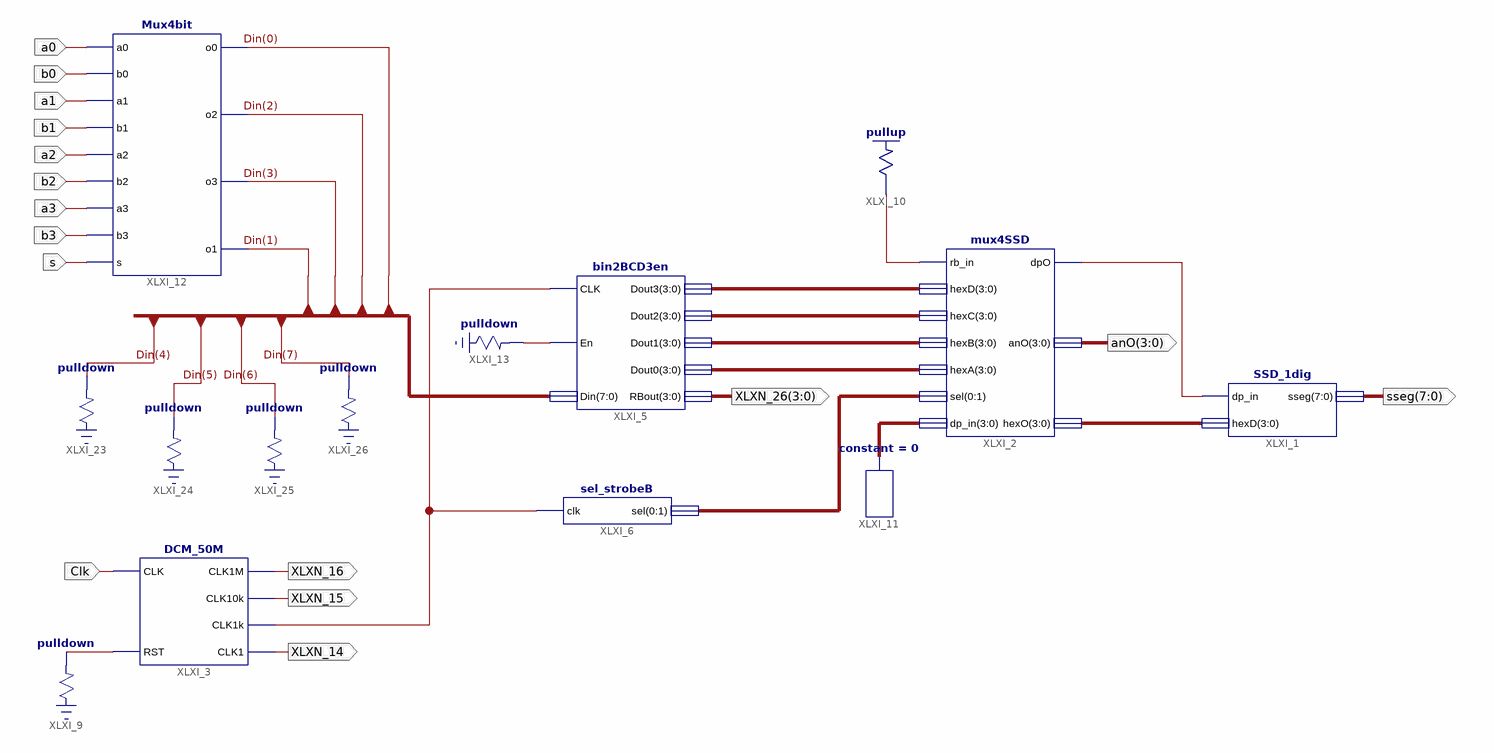
[diagram p0: schematic sheet 1]
// Xilinx ISE schematic Lab6Exp5.sch (spartan3e) as structural Verilog: 14 symbols, 16 ports
module Lab6Exp5 (
  input  a0,
  input  b2,
  input  a2,
  input  b1,
  input  a1,
  input  b0,
  input  a3,
  input  b3,
  input  s,
  input  Clk,
  output [3:0] anO,
  output [7:0] sseg,
  output [3:0] XLXN_26,
  output XLXN_14,
  output XLXN_15,
  output XLXN_16
);

  wire En, XLXN_18, XLXN_21, XLXN_22, XLXN_49;
  wire [1:0] XLXN_12;
  wire [3:0] XLXN_1, XLXN_4, XLXN_5, XLXN_6, XLXN_9, XLXN_11;
  wire [7:0] Din;

  SSD_1dig XLXI_1 (.dp_in(XLXN_49), .hexD(XLXN_1), .sseg(sseg));
  mux4SSD XLXI_2 (
    .rb_in(XLXN_22), .hexD(XLXN_11), .hexC(XLXN_9), .hexB(XLXN_6), .hexA(XLXN_5),
    .sel({XLXN_12[0], XLXN_12[1]}), .dp_in(XLXN_4), .dpO(XLXN_49), .anO(anO), .hexO(XLXN_1));
  \pullup  XLXI_10 (.O(XLXN_22));
  bin2BCD3en XLXI_5 (
    .CLK(XLXN_21), .En(En), .Din(Din), .Dout3(XLXN_11), .Dout2(XLXN_9), .Dout1(XLXN_6), .Dout0(XLXN_5),
    .RBout(XLXN_26));
  sel_strobeB XLXI_6 (.clk(XLXN_21), .sel({XLXN_12[0], XLXN_12[1]}));
  constant #(.CValue("0")) XLXI_11 (.O(XLXN_4));
  \pulldown  XLXI_13 (.O(En));
  Mux4bit XLXI_12 (
    .a0(a0), .b0(b0), .a1(a1), .b1(b1), .a2(a2), .b2(b2), .a3(a3), .b3(b3), .s(s), .o0(Din[0]), .o2(Din[2]),
    .o3(Din[3]), .o1(Din[1]));
  \pulldown  XLXI_9 (.O(XLXN_18));
  DCM_50M XLXI_3 (.CLK(Clk), .RST(XLXN_18), .CLK1M(XLXN_16), .CLK10k(XLXN_15), .CLK1k(XLXN_21), .CLK1(XLXN_14));
  \pulldown  XLXI_23 (.O(Din[4]));
  \pulldown  XLXI_24 (.O(Din[5]));
  \pulldown  XLXI_25 (.O(Din[6]));
  \pulldown  XLXI_26 (.O(Din[7]));
endmodule
